# Altium schematic sheet Power Budget Analysis.SchDoc
size A4; SheetNumber: 2; SheetTotal: 3
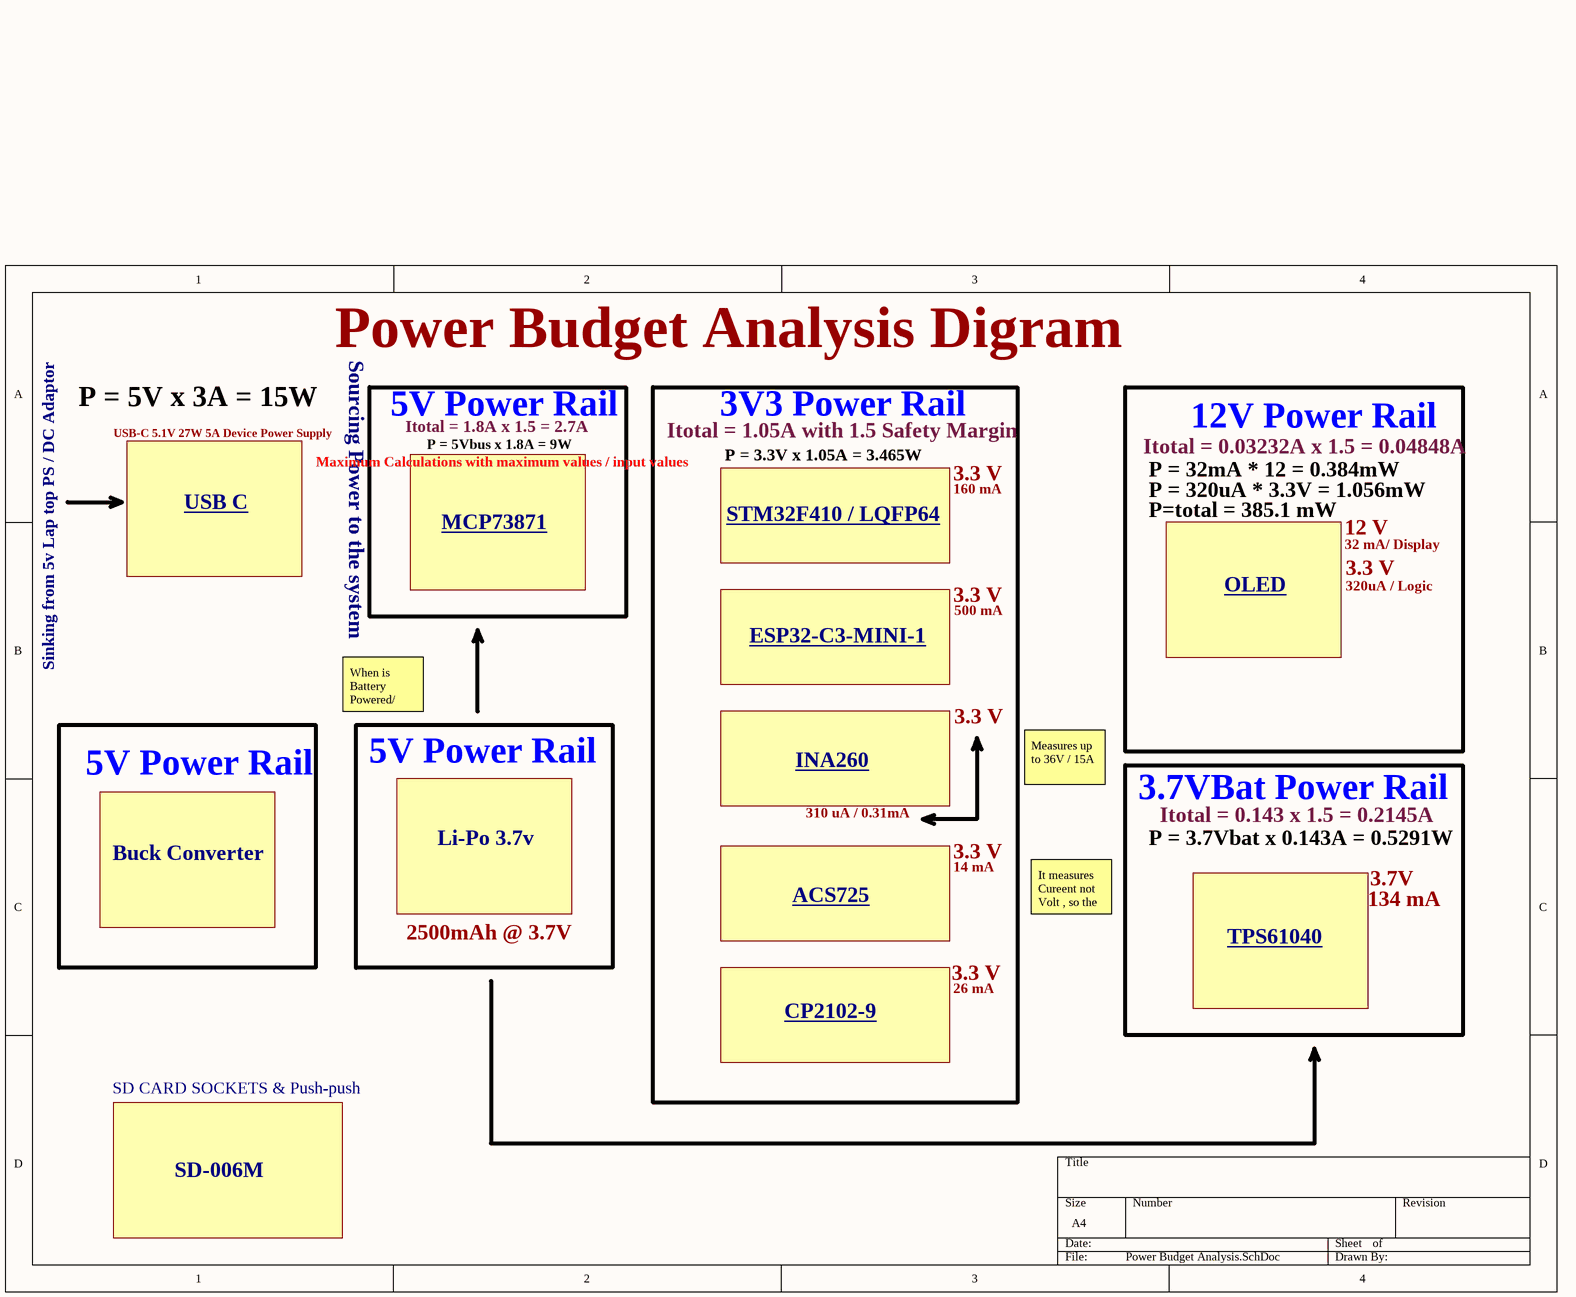
[diagram p0: Power Budget Analysis.SchDoc]

## Notes on the sheet
- Power Budget Analysis Digram
- Sourcing Power to the system
- P = 5V x 3A = 15W
- USB-C 5.1V 27W 5A Device Power Supply
- 5V Power Rail
- Itotal = 1.8A x 1.5 = 2.7A
- Itotal = 1.05A with 1.5 Safety Margin
- 3V3 Power Rail
- 12V Power Rail
- USB C <https://www.altronics.com.au/p/m8822b-usb-c-27w-5a-device-power-supply/?srsltid=AfmBOoqp8nHb2cxk0xsTohLWyo-97Htjdz2jc8KJQuv4jYOgHHm_hLnu4Cg>
- Maximum Calculations with maximum values / input values
- P = 5Vbus x 1.8A = 9W
- P = 3.3V x 1.05A = 3.465W
- 3.3 V
- 160 mA
- Itotal = 0.03232A x 1.5 = 0.04848A
- P = 32mA * 12 = 0.384mW
- P = 320uA * 3.3V = 1.056mW
- MCP73871 <https://ww1.microchip.com/downloads/en/DeviceDoc/MCP73871-Data-Sheet-20002090E.pdf>
- STM32F410 / LQFP64 <https://www.st.com/resource/en/datasheet/stm32f410cb.pdf>
- P=total = 385.1 mW
- 12 V
- 32 mA/ Display
- ESP32-C3-MINI-1 <https://documentation.espressif.com/esp32-c3-mini-1_datasheet_en.pdf>
- 500 mA
- OLED <https://jlcpcb.com/api/file/downloadByFileSystemAccessId/8588905200702926848>
- 320uA / Logic
- Sinking from 5v Lap top PS / DC Adaptor
- When is Battery Powered/ How will Battery Power BMS that is rated at 5V ?
- INA260 <https://www.ti.com/lit/ds/symlink/ina260.pdf?ts=1758555023078>
- Measures up to 36V / 15A
- Li-Po 3.7v
- 310 uA / 0.31mA
- 3.7VBat Power Rail
- P = 3.7Vbat x 0.143A = 0.5291W
- Itotal = 0.143 x 1.5 = 0.2145A
- Buck Converter
- ACS725 <https://www.allegromicro.com/-/media/files/datasheets/acs725-datasheet.ashx>
- 14 mA
- It measures Cureent not Volt , so the Current from Primary conductor you are measuring must be within the range of your IC capability
  >> Measures up to 20A
- 134 mA
- 3.7V
- 2500mAh @ 3.7V
- TPS61040 <https://www.ti.com/lit/ds/symlink/tps61041.pdf?ts=1764240116973&ref_url=https%253A%252F%252Fau.mouser.com%252F>
- CP2102-9 <https://www.silabs.com/documents/public/data-sheets/CP2102-9.pdf>
- 26 mA
- SD CARD SOCKETS & Push-push
- SD-006M